# EAGLE design Eurorack_passive_dist (EAGLE 7.5.0)
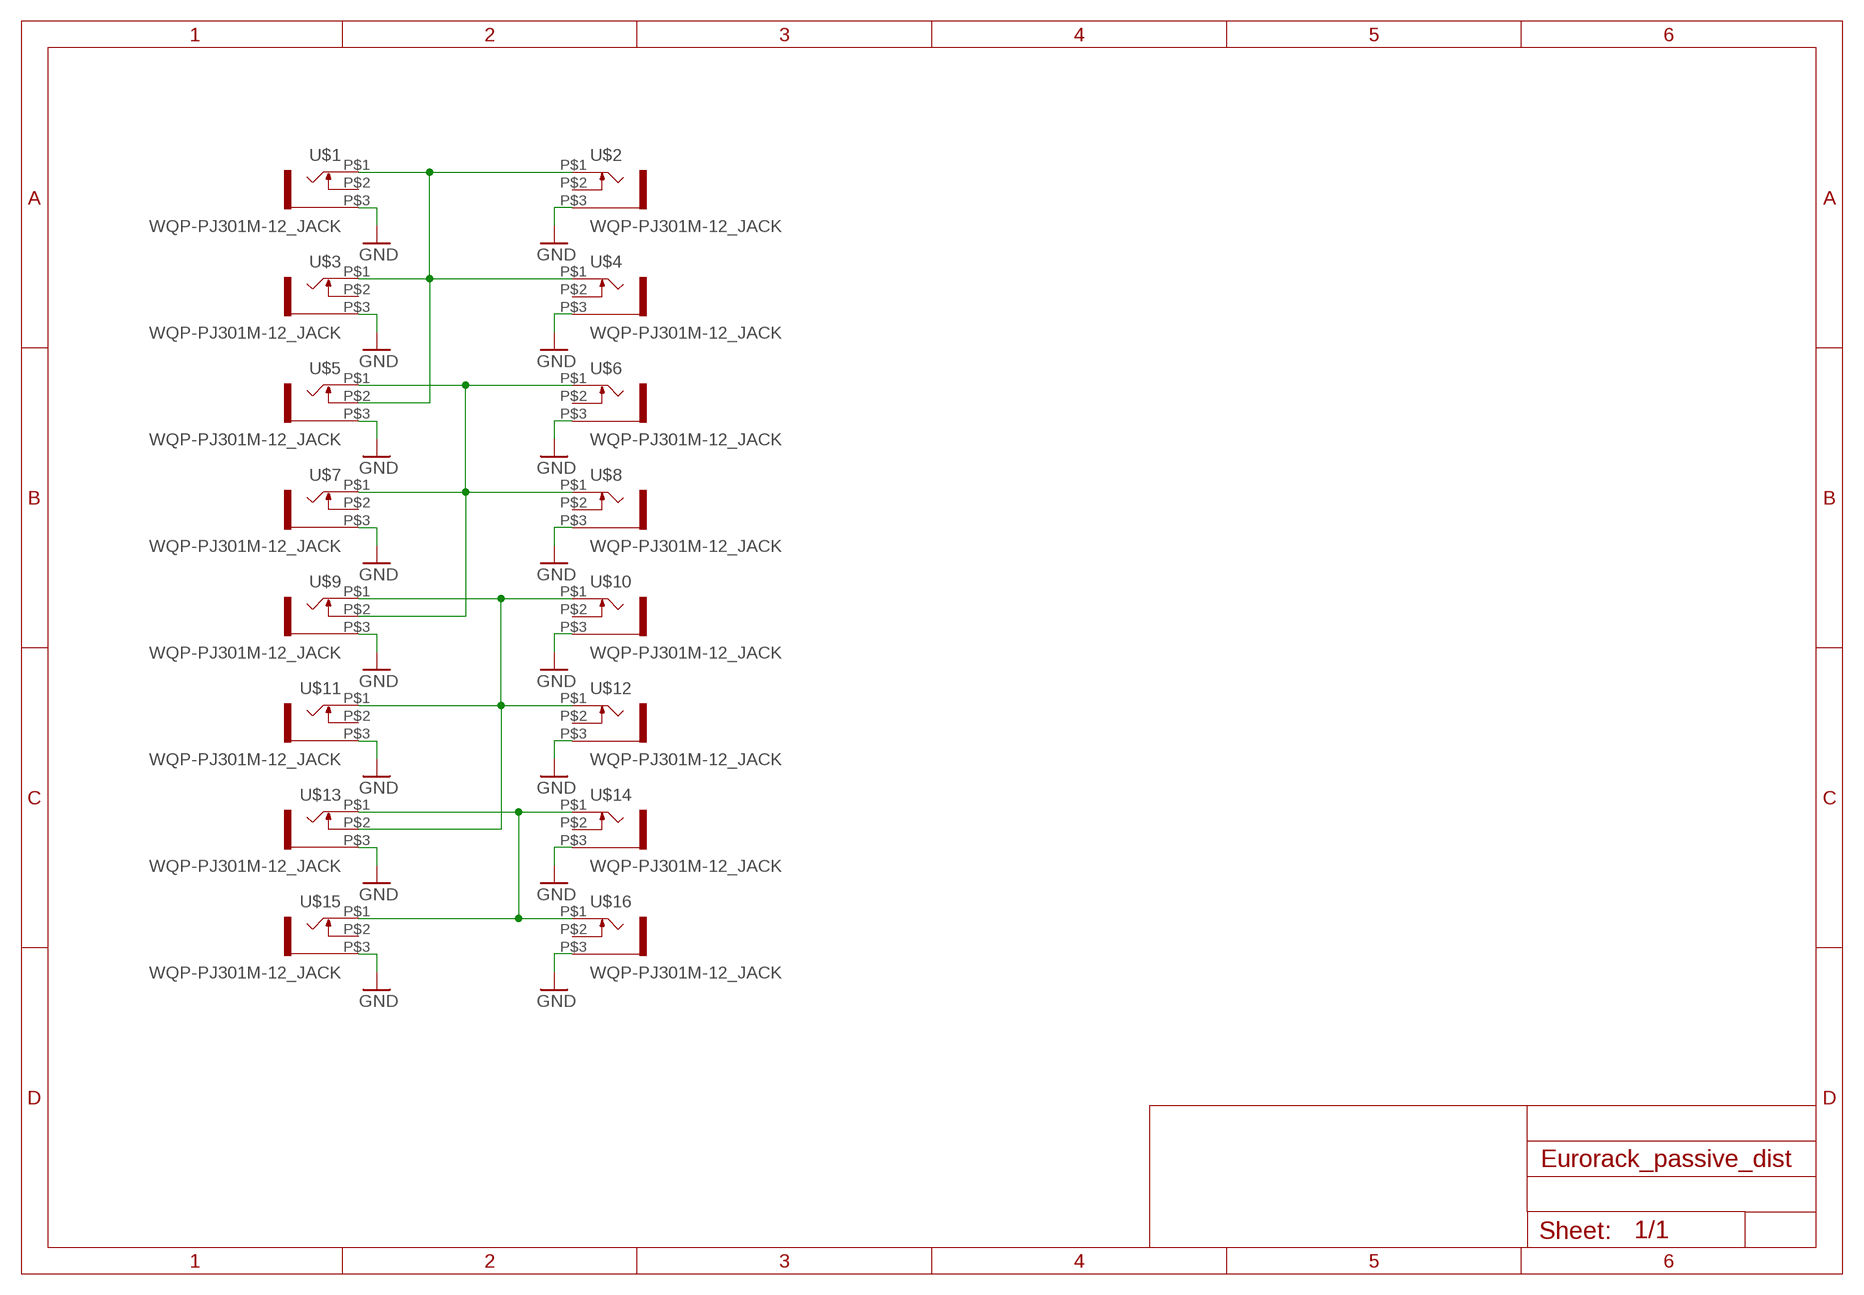
[diagram p0: schematic, sheet 1]

## Parts
U$1  WQP-PJ301M-12_JACK  [WQP-PJ301M-12_JACK]
U$2  WQP-PJ301M-12_JACK  [WQP-PJ301M-12_JACK]
U$3  WQP-PJ301M-12_JACK  [WQP-PJ301M-12_JACK]
U$4  WQP-PJ301M-12_JACK  [WQP-PJ301M-12_JACK]
U$5  WQP-PJ301M-12_JACK  [WQP-PJ301M-12_JACK]
U$6  WQP-PJ301M-12_JACK  [WQP-PJ301M-12_JACK]
U$7  WQP-PJ301M-12_JACK  [WQP-PJ301M-12_JACK]
U$8  WQP-PJ301M-12_JACK  [WQP-PJ301M-12_JACK]
U$9  WQP-PJ301M-12_JACK  [WQP-PJ301M-12_JACK]
U$10  WQP-PJ301M-12_JACK  [WQP-PJ301M-12_JACK]
U$11  WQP-PJ301M-12_JACK  [WQP-PJ301M-12_JACK]
U$12  WQP-PJ301M-12_JACK  [WQP-PJ301M-12_JACK]
U$13  WQP-PJ301M-12_JACK  [WQP-PJ301M-12_JACK]
U$14  WQP-PJ301M-12_JACK  [WQP-PJ301M-12_JACK]
U$15  WQP-PJ301M-12_JACK  [WQP-PJ301M-12_JACK]
U$16  WQP-PJ301M-12_JACK  [WQP-PJ301M-12_JACK]

## Nets
GND: U$1.P$3 U$2.P$3 U$3.P$3 U$4.P$3 U$5.P$3 U$6.P$3 U$7.P$3 U$8.P$3 U$9.P$3 U$10.P$3 U$11.P$3 U$12.P$3 U$13.P$3 U$14.P$3 U$15.P$3 U$16.P$3
N$2: U$1.P$1 U$2.P$1 U$3.P$1 U$4.P$1 U$5.P$2
N$4: U$5.P$1 U$6.P$1 U$7.P$1 U$8.P$1 U$9.P$2
N$6: U$9.P$1 U$10.P$1 U$11.P$1 U$12.P$1 U$13.P$2
N$7: U$13.P$1 U$14.P$1 U$15.P$1 U$16.P$1
Unconnected: U$1.P$2 U$2.P$2 U$3.P$2 U$4.P$2 U$6.P$2 U$7.P$2 U$8.P$2 U$10.P$2 U$11.P$2 U$12.P$2 U$14.P$2 U$15.P$2 U$16.P$2

## Library data of the parts
U$1-U$16 = thonkiconn:WQP-PJ301M-12_JACK

## Board
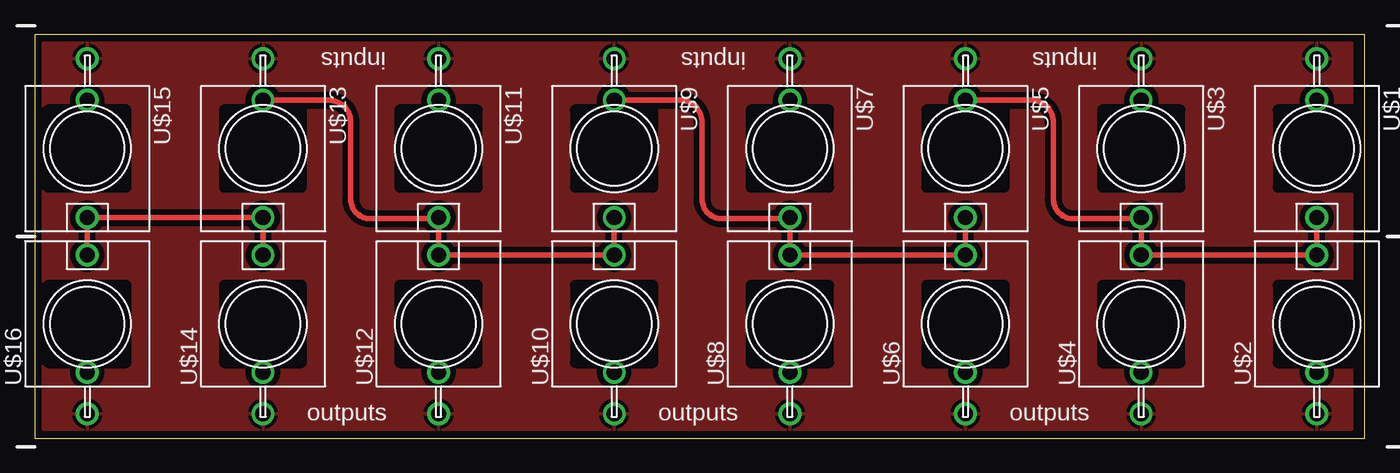
[diagram p1: board, top side]
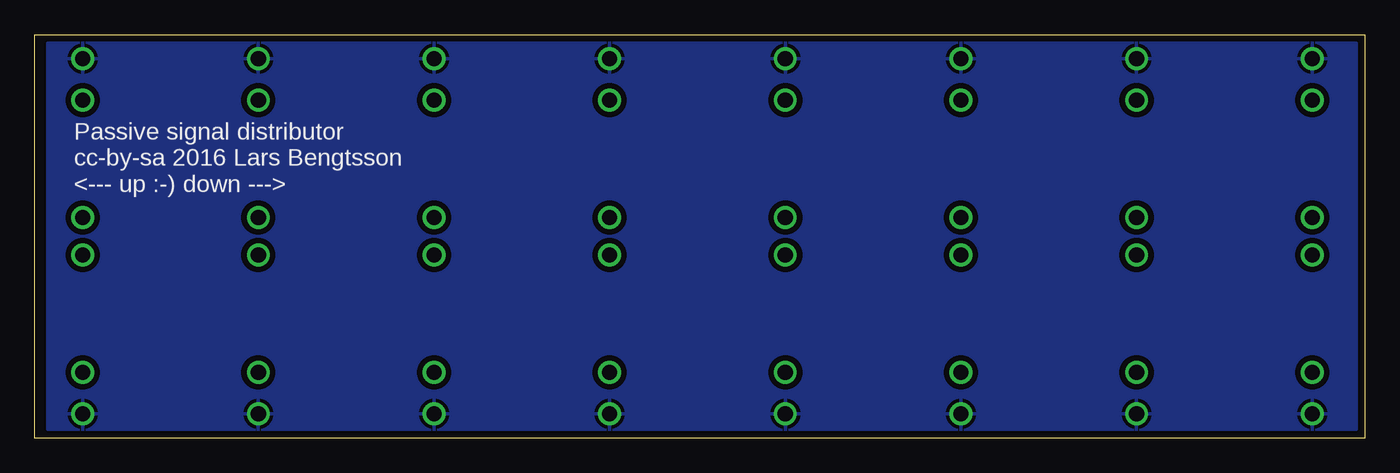
[diagram p2: board, bottom side, seen from below]

Size 96.19 x 29.2 mm. Coordinates in mm from the lower left corner, seen from the top.
Outline: 0,0 96.19,0 96.19,29.2 0,29.2 0,0
Copper layers (1*16): Top 0.0356mm / dielectric 1.5011mm / Bottom 0.0356mm
Design rules "LaenPCBOrder": minimum track width 6mil, minimum drill 13mil, track to track 6mil, track to pad 6mil, pad to pad 6mil, via to via 6mil, smd to smd 6mil, copper to edge 15mil, drill to drill 6mil, minimum pad ring 7mil, minimum via ring 7mil, stop-mask expansion 3mil, vias tented up to drill 0mil, thermal gap 10mil

### Footprints (pad centres in the part's own frame; a part is rotated, then mirrored left to right if it is on the bottom)
WQP-PJ301M-12_JACK = drill 1.1: P$1 0,5; P$2 0,-3.5; P$3 0,-6.5

### Placement (x,y rotation side)
U$1  92.71,20.95 180 top
U$2  92.71,8.26 0 top
U$3  80.01,20.95 180 top
U$4  80.01,8.26 0 top
U$5  67.31,20.95 180 top
U$6  67.31,8.26 0 top
U$7  54.61,20.95 180 top
U$8  54.61,8.26 0 top
U$9  41.91,20.95 180 top
U$10  41.91,8.26 0 top
U$11  29.21,20.95 180 top
U$12  29.21,8.26 0 top
U$13  16.51,20.95 180 top
U$14  16.51,8.26 0 top
U$15  3.81,20.95 180 top
U$16  3.81,8.26 0 top

### Tracks (layer width: path | path; a pad name or v marks a point on that pad's centre or on a via)
GND
  pour Bottom (isolate 0.406): 0.64,28.57 95.25,28.57 95.25,0.63 0.64,0.63
  pour Top (isolate 0.406): 0.64,28.57 95.25,28.57 95.25,0.63 0.64,0.63
N$2
  Top 0.406: U$5.P$2 72.07,24.45 arc-90 73.66,22.86 73.66,17.3 arc90 75.08,15.88 80.01,15.88 U$3.P$1 U$4.P$1 U$2.P$1 U$1.P$1
N$4
  Top 0.406: U$9.P$2 46.67,24.45 arc-90 48.26,22.86 48.26,17.3 arc90 49.68,15.88 54.61,15.88 U$7.P$1 U$8.P$1 U$6.P$1 U$5.P$1
N$6
  Top 0.406: U$13.P$2 21.27,24.45 arc-90 22.86,22.86 22.86,17.3 arc90 24.28,15.88 29.21,15.88 U$11.P$1 U$12.P$1 U$10.P$1 U$9.P$1
N$7
  Top 0.406: U$14.P$1 U$13.P$1 U$15.P$1 U$16.P$1

### Text on the board
tPlace: inputs | inputs | inputs | outputs | outputs | outputs
bPlace: Passive signal distributor / cc-by-sa 2016 Lars Bengtsson / <--- up :-) down --->